# Altium schematic sheet Displays.SchDoc
size B
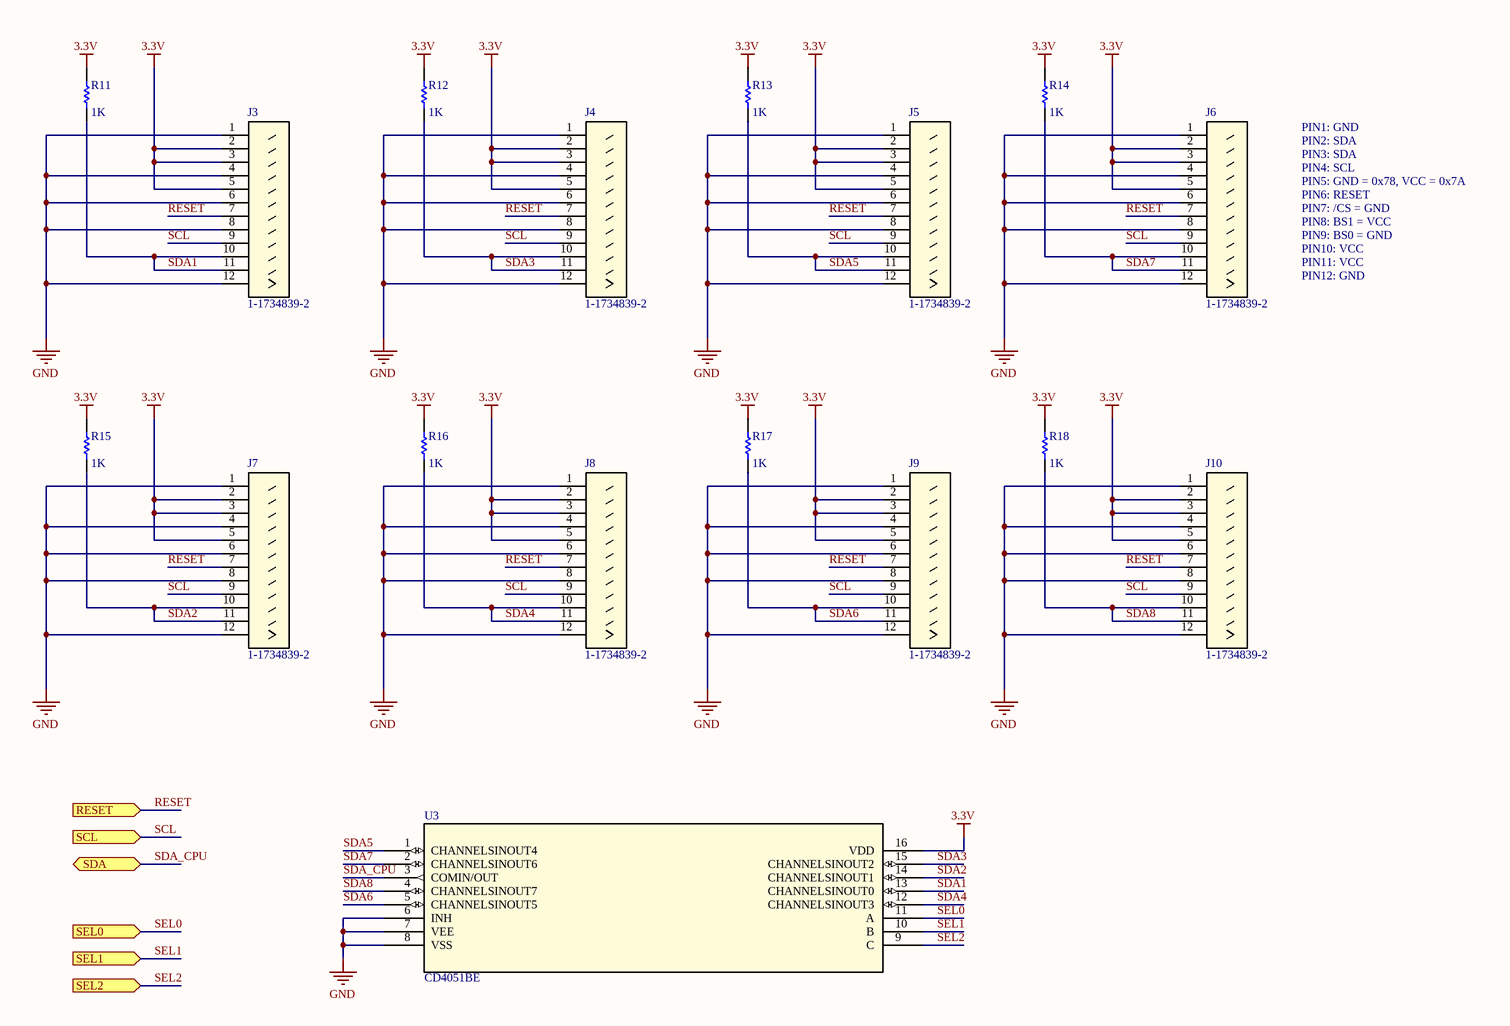
[diagram p0: Displays.SchDoc]

## Parts
J3  1-1734839-2  [CONN_1-1734592-2]
J4  1-1734839-2  [CONN_1-1734592-2]
J5  1-1734839-2  [CONN_1-1734592-2]
J6  1-1734839-2  [CONN_1-1734592-2]
J7  1-1734839-2  [CONN_1-1734592-2]
J8  1-1734839-2  [CONN_1-1734592-2]
J9  1-1734839-2  [CONN_1-1734592-2]
J10  1-1734839-2  [CONN_1-1734592-2]
R11  value 1K  [6-0805_N]
R12  value 1K  [6-0805_N]
R13  value 1K  [6-0805_N]
R14  value 1K  [6-0805_N]
R15  value 1K  [6-0805_N]
R16  value 1K  [6-0805_N]
R17  value 1K  [6-0805_N]
R18  value 1K  [6-0805_N]
U3  CD4051BE  [N16]

## Ports
RESET (in), SCL (in), SDA, SEL0 (in), SEL1 (in), SEL2 (in)

## Nets
3.3V: J3.2 J3.3 J3.5 J4.2 J4.3 J4.5 J5.2 J5.3 J5.5 J6.2 J6.3 J6.5 J7.2 J7.3 J7.5 J8.2 J8.3 J8.5 J9.2 J9.3 J9.5 J10.2 J10.3 J10.5 R11.1 R12.1 R13.1 R14.1 R15.1 R16.1 R17.1 R18.1 U3.16(VDD)
GND: J3.1 J3.4 J3.6 J3.8 J3.12 J4.1 J4.4 J4.6 J4.8 J4.12 J5.1 J5.4 J5.6 J5.8 J5.12 J6.1 J6.4 J6.6 J6.8 J6.12 J7.1 J7.4 J7.6 J7.8 J7.12 J8.1 J8.4 J8.6 J8.8 J8.12 J9.1 J9.4 J9.6 J9.8 J9.12 J10.1 J10.4 J10.6 J10.8 J10.12 U3.6(INH) U3.7(VEE) U3.8(VSS)
RESET: J3.7 J4.7 J5.7 J6.7 J7.7 J8.7 J9.7 J10.7 ; port RESET
SCL: J3.9 J4.9 J5.9 J6.9 J7.9 J8.9 J9.9 J10.9 ; port SCL
SDA1: J3.10 J3.11 R11.2 U3.13(CHANNELSINOUT0)
SDA2: J7.10 J7.11 R15.2 U3.14(CHANNELSINOUT1)
SDA3: J4.10 J4.11 R12.2 U3.15(CHANNELSINOUT2)
SDA4: J8.10 J8.11 R16.2 U3.12(CHANNELSINOUT3)
SDA5: J5.10 J5.11 R13.2 U3.1(CHANNELSINOUT4)
SDA6: J9.10 J9.11 R17.2 U3.5(CHANNELSINOUT5)
SDA7: J6.10 J6.11 R14.2 U3.2(CHANNELSINOUT6)
SDA8: J10.10 J10.11 R18.2 U3.4(CHANNELSINOUT7)
SDA_CPU: U3.3(COMIN/OUT) ; port SDA
SEL0: U3.11(A) ; port SEL0
SEL1: U3.10(B) ; port SEL1
SEL2: U3.9(C) ; port SEL2

## Notes on the sheet
- PIN1: GND
- PIN2: SDA
- PIN3: SDA
- PIN4: SCL
- PIN5: GND = 0x78, VCC = 0x7A
- PIN7: /CS = GND
- PIN6: RESET
- PIN8: BS1 = VCC
- PIN9: BS0 = GND
- PIN10: VCC
- PIN11: VCC
- PIN12: GND

## Library data of the parts
J3-J10 = 1-1734839-2: Imported; Manufacturer_Name: Tyco Electronics Amp; Vendor: Tyco Electronics; Supersection: Connectors; Section: General Purpose; C: Copyright (C) 2015 Accelerated Designs. All rights reserved; Manufacturer_Part_Number: 1-1734839-2; Family: Headers and PCB Receptacles; Copyright: Copyright (C) 2015 Accelerated Designs. All rights reserved; RS_Part_Number: 7188674; Value: Value; Type: Type; RefDes: RefDes
R11-R18 = Res1: Resistor; Published: 8-Jun-2000; LatestRevisionDate: 17-Jul-2002; LatestRevisionNote: Re-released for DXP Platform.; PackageReference: AXIAL-0.3; Publisher: Altium Limited; PackageDescription: Axial Device, Thru-Hole; 2 Leads; 0.3 in Pin Spacing
U3 = CD4051BE: Imported; Vendor: Texas Instruments; Section: Switches and Multiplexers; C: Copyright (C) 2015 Accelerated Designs. All rights reserved; Manufacturer_Part_Number: CD4051BE; Family: Analogue Switch Multiplexer; Manufacturer_Name: Texas Instruments; Copyright: Copyright (C) 2015 Accelerated Designs. All rights reserved; RS_Part_Number: 5036098; Value: Value; Type: Type; RefDes: RefDes